# EAGLE design LoadSwitch (EAGLE 9.6.2)
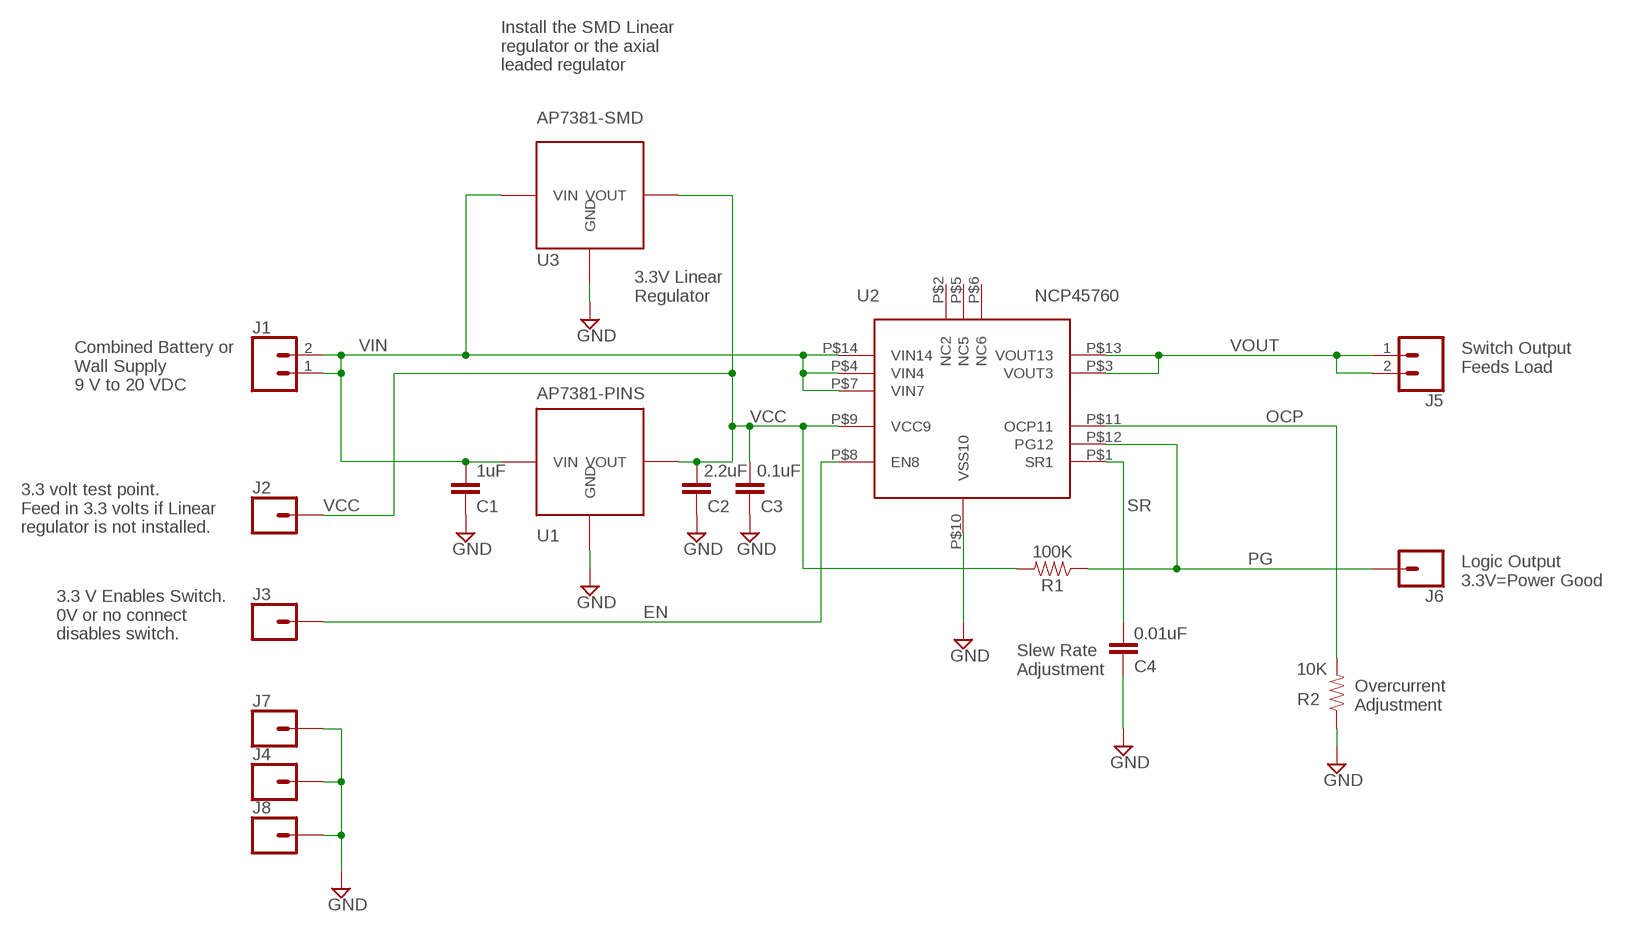
[diagram p0: schematic, sheet 1]

## Parts
C1  1uF  0805_CAP  [0805_CAP]
C2  2.2uF  0805_CAP  [0805_CAP]
C3  0.1uF  0805_CAP  [0805_CAP]
C4  0.01uF  0805_CAP  [0805_CAP]
J1  CONN_02  [1X02]
J2  CONN_01  [1X01]
J3  CONN_01  [1X01]
J4  CONN_01  [1X01]
J5  CONN_02  [1X02]
J6  CONN_01  [1X01]
J7  CONN_01  [1X01]
J8  CONN_01  [1X01]
R1  100K  0603_RESISTOR  [0603_RESISTOR]
R2  10K  0603_RESISTOR  [0603_RESISTOR]
U1  AP7381-PINS  AP7381_PINS  [AP7381_PINS]
U2  NCP45760  [NCP45760]
U3  AP7381-SMD  AP7381  [AP7381]

## Nets
EN: J3.1 U2.P$8(EN8)
GND: C1.2 C2.2 C3.2 C4.2 J4.1 J7.1 J8.1 R2.1 U1.P$2(GND) U2.P$10(VSS10) U3.P$3(GND) U3.P$4(GND)
OCP: R2.2 U2.P$11(OCP11)
PG: J6.1 R1.1 U2.P$12(PG12)
SR: C4.1 U2.P$1(SR1)
VCC: C2.1 C3.1 J2.1 R1.2 U1.P$1(VOUT) U2.P$9(VCC9) U3.P$1(VOUT)
VIN: C1.1 J1.1 J1.2 U1.P$3(VIN) U2.P$4(VIN4) U2.P$7(VIN7) U2.P$14(VIN14) U3.P$2(VIN)
VOUT: J5.1 J5.2 U2.P$3(VOUT3) U2.P$13(VOUT13)
Unconnected: U2.P$2(NC2) U2.P$5(NC5) U2.P$6(NC6)

## Notes on the sheet
- Install the SMD Linear
  regulator or the axial
  leaded regulator
- 3.3V Linear 
  Regulator
- Switch Output
  Feeds Load
- Combined Battery or 
  Wall Supply 
  9 V to 20 VDC
- 3.3 volt test point.
  Feed in 3.3 volts if Linear 
  regulator is not installed.
- Logic Output
  3.3V=Power Good
- 3.3 V Enables Switch.
  0V or no connect
  disables switch.
- Slew Rate 
  Adjustment
- Overcurrent
  Adjustment

## Library data of the parts
C1-C4 = 0805_CAP:0805_CAP
J1 J5 = SparkFun-Connectors:CONN_02: Multi connection point. Often used as Generic Header-pin footprint for 0.1 inch spaced/style header connections On any of the 0.1 inch spaced packages, you can populate with these: Break Away Headers - Straight <https://www.sparkfun.com/products/116> (PRT-00116) Break Away Male Headers - Right Angle <https://www.sparkfun.com/products/553> (PRT-00553) Female Headers <https://www.sparkfun.com/products/115> (PRT-00115) Break Away Headers - Machine Pin <https://www.sparkfun.com/products/117> (PRT-00117) Break Away Female Headers - Swiss Machine Pin <https://www.sparkfun.com/products/743> (PRT-00743) For SCREWTERMINALS and SPRING TERMINALS visit here: Screw Terimnals on SparkFun.com <https://www.sparkfun.com/search/results?term=Screw+Terminals> (5mm/3.5mm/2.54mm spacing) This device is also useful as a general connection point to wire up your design to another part of your project. Our various solder wires solder well into these plated through hole pads. Hook-Up Wire - Assortment (Stranded, 22 AWG) <https://www.sparkfun.com/products/11375> (PRT-11375) Hook-Up Wire - Assortment (Solid Core, 22 AWG) <https://www.sparkfun.com/products/11367> (PRT-11367) View the entire wire category on our website here <https://www.sparkfun.com/categories/141> Special notes: Molex polarized connector foot print use with: PRT-08233 with associated crimp pins and housings. 2.54_SCREWTERM for use with PRT-10571. 3.5mm Screw Terminal footprints for PRT-08084 5mm Screw Terminal footprints for use with PRT-08432
J2-J4 J6-J8 = SparkFun-Connectors:CONN_01: Single connection point. Often used as Generic Header-pin footprint for 0.1 inch spaced/style header connections On any of the 0.1 inch spaced packages, you can populate with these: Break Away Headers - Straight <https://www.sparkfun.com/products/116> (PRT-00116) Break Away Male Headers - Right Angle <https://www.sparkfun.com/products/553> (PRT-00553) Female Headers <https://www.sparkfun.com/products/115> (PRT-00115) Break Away Headers - Machine Pin <https://www.sparkfun.com/products/117> (PRT-00117) Break Away Female Headers - Swiss Machine Pin <https://www.sparkfun.com/products/743> (PRT-00743) This device is also useful as a general connection point to wire up your design to another part of your project. Our various solder wires solder well into these plated through hole pads. Hook-Up Wire - Assortment (Stranded, 22 AWG) <https://www.sparkfun.com/products/11375> (PRT-11375) Hook-Up Wire - Assortment (Solid Core, 22 AWG) <https://www.sparkfun.com/products/11367> (PRT-11367) View the entire wire category on our website here <https://www.sparkfun.com/categories/141> Special notes: SMTSO-256-ET is a "flush mount" nut for a 4-40 screw. We mostly use this on specialty testbeds; it is a nice way to connect hardware to your PCB at an adjustable hieght. Also note, the SNAP packages are for using a snappable style connector. We sell a baggie of snaps and they are also used on two LilyPad designs: Snap Assortment - 30 pack (male and female) <https://www.sparkfun.com/products/11347> (DEV-11347) LilyPad Arduino SimpleSnap <https://www.sparkfun.com/products/10941> (DEV-10941) LilyPad SimpleSnap Protoboard <https://www.sparkfun.com/products/10940> (DEV-10940)
R1 R2 = 0603_RESISTOR:0603_RESISTOR
U1 = AP7381_PINS:AP7381_PINS
U2 = NCP45760:NCP45760
U3 = AP7381:AP7381

## Board
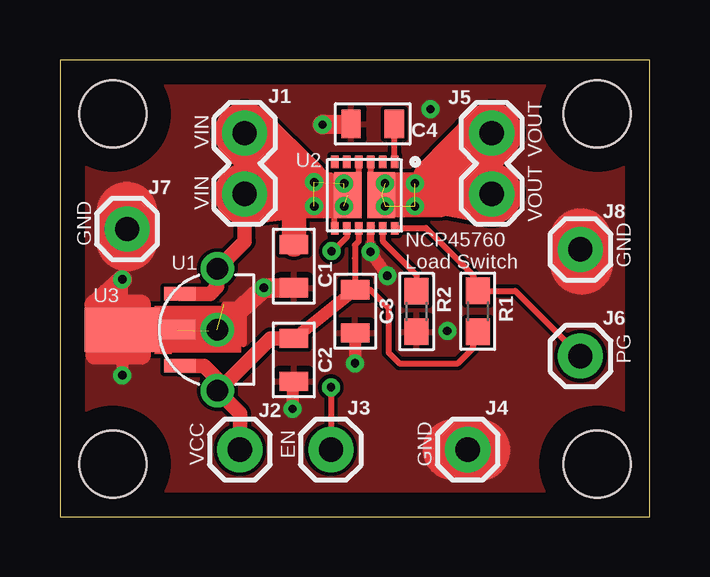
[diagram p1: board, top side]
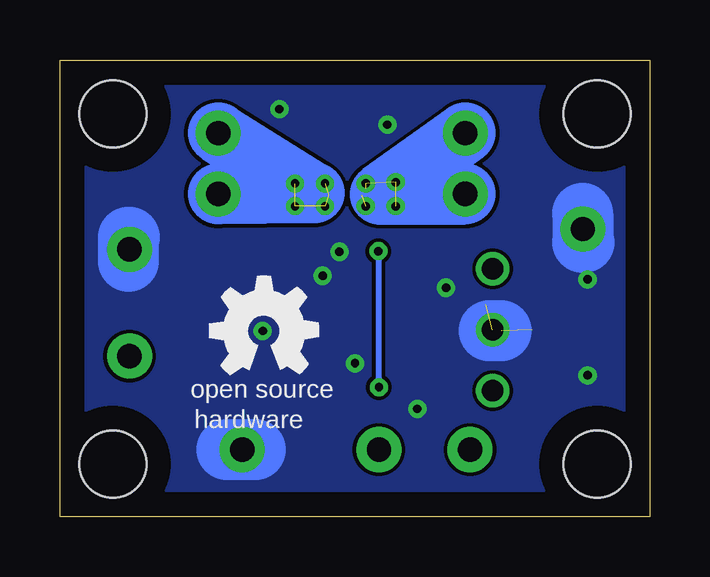
[diagram p2: board, bottom side, seen from below]

Size 24.6 x 19.05 mm. Coordinates in mm from the lower left corner, seen from the top.
Outline: 0,0 24.6,0 24.6,19.05 0,19.05 0,0
Copper layers (1*16): Top 0.035mm / dielectric 1.5mm / Bottom 0.035mm
Design rules "default": minimum track width 6mil, minimum drill 0.35mm, track to track 6mil, track to pad 6mil, pad to pad 6mil, via to via 6mil, smd to smd 6mil, copper to edge 40mil, drill to drill 6mil, minimum pad ring 10mil, minimum via ring 8mil, stop-mask expansion 4mil, vias tented up to drill 0mil, thermal gap 10mil
Holes 2.8 mm at 2.2,2.2 22.4,2.2 2.2,16.8 22.4,16.8

### Footprints (pad centres in the part's own frame; a part is rotated, then mirrored left to right if it is on the bottom)
0805_CAP = smd 0.8 x 1.2: 1 -0.9,0; 2 0.9,0
1X02 = drill 1.016 pad 1.88: 1 0,0; 2 2.54,0
1X01 = drill 1.016 pad 1.88: 1 0,0
0603_RESISTOR = smd 1.1 x 1: 1 -0.85,0; 2 0.85,0
AP7381_PINS = drill 0.889: P$1 -2.54,0; P$2 0,0; P$3 2.54,0
NCP45760 = smd 0.31 x 0.53: P$1 0,0; P$2 0.5,0; P$3 1,0; P$4 1.5,0; P$5 2,0; P$6 2.5,0; P$7 2.5,2.77; P$8 1.99,2.77; P$9 1.5,2.77; P$10 1,2.77; P$11 0.5,2.77; P$12 0,2.77 | smd 1.15 x 1.9: P$13 0.55,1.385; P$14 1.95,1.385
AP7381 = smd 0.55 x 1.3: P$1 -1.5,0; P$2 1.5,0 | smd 0.8 x 1.475: P$3 0,0.1 | smd 1.85 x 3.125: P$4 0,2.4

### Placement (x,y rotation side)
C1  9.75,10.45 270 top
C2  9.75,6.54 270 top
C3  12.31,8.57 270 top
C4  13.04,16.38 180 top
J1  7.7,16 270 top
J2  7.5,2.8 0 top
J3  11.3,2.8 0 top
J4  17,2.8 0 top
J5  18,16 270 top
J6  21.7,6.7 0 top
J7  2.8,12 0 top
J8  21.7,11.15 0 top
R1  17.42,8.57 270 top
R2  14.87,8.56 90 top
U1  6.56,7.8 90 top
U2  13.95,14.8 180 top
U3  5,7.8 90 top
U$1  [OSHW_5MM]  16.1,7.75 0 bottom

### Tracks (layer width: path | path; a pad name or v marks a point on that pad's centre or on a via)
EN  (via drill 0.35)
  Top 0.254: U2.P$8 11.96,11.66 11.35,11.05 v11.32,11.07 | v11.3,5.4 11.3,2.5 J3.1
  Bottom 0.254: v11.32,11.07 11.32,5.42 v11.3,5.4
GND  (via drill 0.35)  (2 unrouted)
  Top 0.254: 6.85,8.85 7.65,8.85 7.65,7.2
  Top 0.305: U2.P$10 v12.95,11.05
  Top 0.508: v2.6,5.9 U3.P$4 v2.6,9.9 | C2.2 9.7,5.59 v9.7,4.5 | C3.2 v12.31,6.41 v12.3,6.4 | v12.95,11.05 v13.65,10.05
  Top 0.61: 5,7.8 U3.P$4
  Top 0.813: 5,7.8 U1.P$2 v8.5,9.55 C1.2 | C4.2 v10.95,16.35 | v2.6,9.9 1.45,8.85 1.45,8.82 1.47,8.82 1.47,6.75 3.39,6.75 3.39,8.85 1.42,8.85
  Top 2.54: 16.4,2.8 17.5,2.8 17.5,2.75 | 2.8,12.7 2.8,11.5 | 21.7,11.6 21.7,10.55 21.8,10.55
  Bottom 2.54: 2.8,12.65 2.8,11.45 2.75,11.45 | 16.45,2.8 17.65,2.8 | 21.7,11.65 21.75,11.65 21.75,10.65 | 6.2,7.75 6.7,7.75
  other vias: 15.45,17 16.15,7.75
  pour Top: 0,0 0,19.05 24.6,19.05 24.6,0
  pour Bottom: 0,0 0,19.05 24.6,19.05 24.6,0
OCP
  Top 0.254: U2.P$11 13.45,11.5 14.87,10.08 R2.2
PG
  Top 0.254: U2.P$12 13.97,12.05 15.25,12.05 17.2,10.1 R1.1 18.98,9.42 J6.1
SR
  Top 0.254: U2.P$1 C4.1
VCC
  Top 0.254: U2.P$9 12.45,11.48 12.29,11.32 12.29,10.78 12.31,10.76 C3.1 12.93,9.47 13.7,8.7 13.7,6.85 14.15,6.4 16.6,6.4 17.2,7 R1.2
  Top 0.508: C3.1 C2.1
  Top 0.61: U3.P$1 6,6.3 6.56,5.74 U1.P$1 | C2.1 8.79,7.44 6.61,5.26 U1.P$1 | U1.P$1 7.5,4.32 J2.1
VIN  (via drill 0.35)  (4 unrouted)
  Top 0.254: U2.P$4 12.45,13.87 U2.P$14 | U2.P$7 11.45,12.7 11.45,12.95 11.45,13.4 11.45,14.08
  Top 0.508: 11.84,13.69 11.45,14.08 | U2.P$14 11.31,14.1 10.35,14.1 10,13.75 11.15,12.7 | J1.2 9.4,12.7 9.75,12.7 11.15,12.7 | 11.15,12.7 11.45,12.7
  Top 0.61: J1.2 7.7,11.48 U1.P$3 6.56,9.61 6.25,9.3 U3.P$2
  Top 1.016: 10,13.75 11.45,12.95 | J1.1 11.45,13.4 | C1.1 9.75,12.7
  Top 2.54: J1.1 10,13.75 J1.2
  Bottom 2.54: J1.1 11.25,13.45 J1.2
  other vias: 11.85,13.9 11.85,12.95 10.6,13.95 10.6,12.95
VOUT  (via drill 0.35)  (4 unrouted)
  Top 0.254: U2.P$3 12.95,13.87 U2.P$13
  Top 1.016: U2.P$13 13.84,13.85 15.9,13.85 | U2.P$13 13.81,13 15.85,13 15.44,13.41 U2.P$13
  Top 2.54: J5.1 15.9,13.85 J5.2
  Bottom 2.54: J5.1 14,13.5 J5.2
  other vias: 14.8,13.9 14.8,12.95 13.55,12.95 13.55,13.9
(copper drawn outside any net)
  shapes: Top area x2

### Text on the board
tPlace: VIN | VOUT | VIN | VOUT | GND | U1 | NCP45760 / Load Switch | GND | PG | VCC | EN | GND